# Altium schematic sheet [11]-BATTERY_BACKUP.SchDoc
size A4
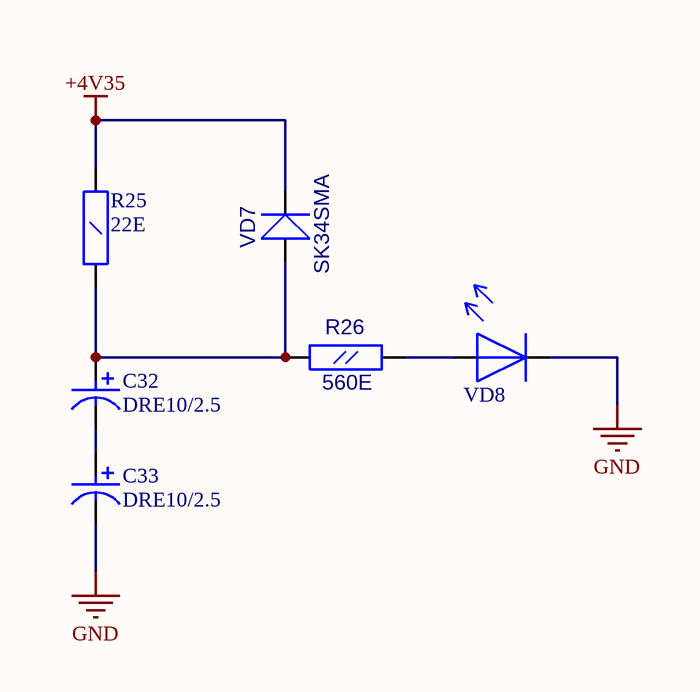
[diagram p0: [11]-BATTERY_BACKUP.SchDoc]

## Parts
C32  DRE10/2.5  [CAP_D12.5_H25]
C33  DRE10/2.5  [CAP_D12.5_H25]
R25  22E  [R2512]
R26  560E  [RC0603]
VD7  SK34SMA  [SMA]
VD8  LED_0805  [LED0805]  (value not drawn)

## Nets
+4V35: R25.2(B) VD7.2(K)
GND: C33.1 VD8.2
NetC32_1: C32.1 C33.2
NetC32_2: C32.2 R25.1(A) R26.1(A) VD7.1(A)
NetR26_2: R26.2(B) VD8.1

## Library data of the parts
C32 C33 = SUPERCAP_10F: Value: DRE10/2.5
R25 = RC2512: Resistor 2512 1W; Value: 22E
R26 = RC0603: Value: 560E
VD7 = SK34SMA: Schottky Rectifier; Value: {Value}
VD8 = LED_0805: Value: LED_0805